# EAGLE board Talon_SDI12 (EAGLE 9.6.2)
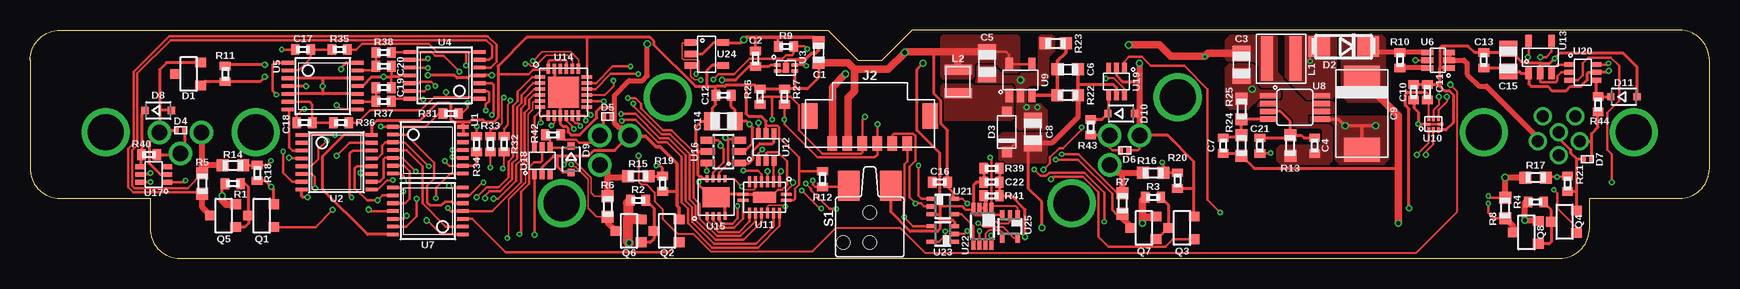
[diagram p3: board, top side]
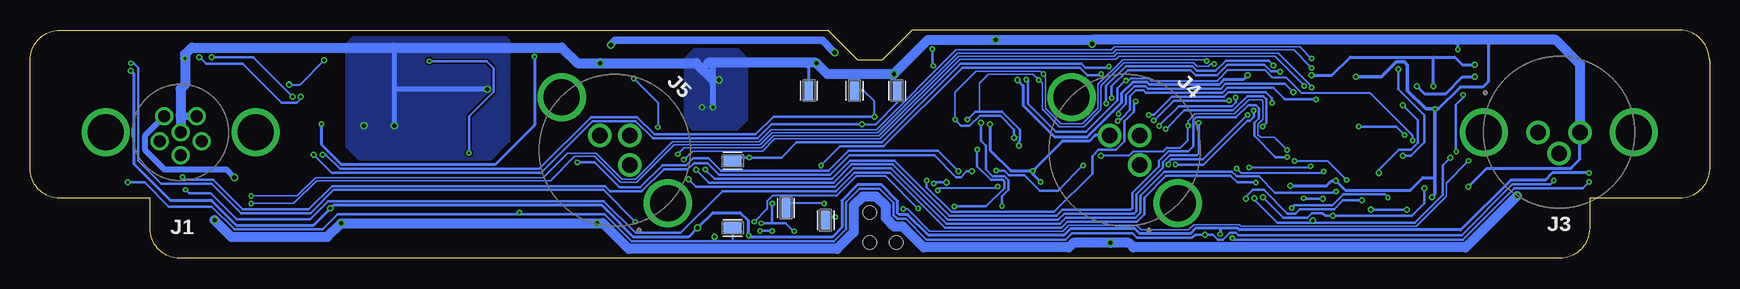
[diagram p4: board, bottom side, seen from below]

Size 140 x 19 mm. Coordinates in mm from the lower left corner, seen from the top.
Outline: 130,5 137.5,5 arc90 140,7.5 140,16.5 arc90 137.5,19 73.5,19 71,16.5 69,16.5 66.5,19 2.5,19 arc90 0,16.5 0,7.5 arc90 2.5,5 10,5 10,2.5 arc90 12.5,0 127.5,0 arc90 130,2.5 130,5
Copper layers (1*16): Top 0.035559375mm / dielectric 1.6mm / Bottom 0.035559375mm
Design rules "jlcpcb-2layer *": minimum track width 5mil, minimum drill 0.2mm, track to track 5mil, track to pad 5mil, pad to pad 5mil, via to via 5mil, smd to smd 5mil, copper to edge 15mil, drill to drill 10mil, minimum pad ring 5mil, minimum via ring 5mil, stop-mask expansion 2.5mil, vias tented up to drill 0mil, thermal gap 10mil

## Footprints (pad centres in the part's own frame; a part is rotated, then mirrored left to right if it is on the bottom)
C0603 = smd 1 x 1: 1 -0.85,0; 2 0.85,0
C0402 = smd 0.7 x 0.9: 1 -0.65,0; 2 0.65,0
C0805 = smd 1.3 x 1.5: 1 -0.95,0; 2 0.95,0
C2917 = smd 2 x 3: + -3,0; - 3,0
SOT23-3 = smd 0.8 x 0.9: 1 -0.95,-1; 2 0.95,-1; 3 0,1.1
DO214AC = smd 1.8 x 1.7: A 2.05,0; C -2.05,0
SOD-123 = smd 0.85 x 0.85: ANODE 1.675,0; CAT -1.675,0
D0402 = smd 0.4 x 0.7: 1 -0.35,0; 2 0.35,0
SOD323-R = smd 0.6 x 0.6: A 1.1,0; C -1.1,0
1X06_M8_PHOENIX_1456022_BOARDLOCK = drill 1: 1 -1.365,-1.32; 2 1.365,-1.32; 3 1.75,0.74; 4 0,1.9; 5 -1.75,0.74; 6 0,0 | drill 3: MNT@1 -6.25,0; MNT@2 6.25,0
1X06_MICROLOCKPLUS = smd 0.8 x 1.2: 1 -3.125,-0.6; 2 -1.875,-0.6; 3 -0.625,-0.6; 4 0.625,-0.6; 5 1.875,-0.6; 6 3.125,-0.6 | smd 1.3 x 2.15: BODY@1 -5.025,1.695; BODY@2 5.025,1.695
1X03_M8_TE_T40410_BOARDLOCK = drill 1.3: 1 1.75,0; 3 -1.75,0; 4 0,1.75 | drill 3: BODY@1 -6.25,0; BODY@2 6.25,0
WE-MAIA(4.1X4.1) = smd 0.98 x 3.7: P$1 -1.185,0; P$2 1.185,0
1008 = smd 0.85 x 2.3: 1 -0.975,0; 2 0.975,0
R0402 = smd 0.7 x 0.9: 1 -0.65,0; 2 0.65,0
R0603 = smd 1 x 1: 1 -0.85,0; 2 0.85,0
ESE-22MH = smd 1.8 x 2.5: 1 -1.75,-2.25; 2 1.75,-2.25 | hole 1.1: 0,0; 0,2.5; 2.2,2.5
TESTPOINT_0603 = smd 1.6 x 0.8: 1 0,0
TSSOP14 = smd 0.305 x 0.991: 1 -1.95,-2.918; 2 -1.3,-2.918; 3 -0.65,-2.918; 4 0,-2.918; 5 0.65,-2.918; 6 1.3,-2.918; 7 1.95,-2.918; 8 1.95,2.918; 9 1.3,2.918; 10 0.65,2.918; 11 0,2.918; 12 -0.65,2.918; 13 -1.3,2.918; 14 -1.95,2.918
TSSOP16 = smd 0.305 x 0.991: 1 -2.275,-2.918; 2 -1.625,-2.918; 3 -0.975,-2.918; 4 -0.325,-2.918; 5 0.325,-2.918; 6 0.975,-2.918; 7 1.625,-2.918; 8 2.275,-2.918; 9 2.275,2.918; 10 1.625,2.918; 11 0.975,2.918; 12 0.325,2.918; 13 -0.325,2.918; 14 -0.975,2.918; 15 -1.625,2.918; 16 -2.275,2.918
TDFN_4 = smd 0.55 x 0.3: 1 -0.725,0.25; 2 -0.725,-0.25; 3 0.725,-0.25; 4 0.725,0.25 | smd 0.5 x 0.86: EP 0,0
SC-70_6 = smd 0.47 x 1: 1 -0.65,-0.9; 2 0,-0.9; 3 0.65,-0.9; 4 0.65,0.9; 5 0,0.9; 6 -0.65,0.9
DGK_S-PDSO-G8 = smd 1.45 x 0.45: 1 -2.2,0.975; 2 -2.2,0.325; 3 -2.2,-0.325; 4 -2.2,-0.975; 5 2.2,-0.975; 6 2.2,-0.325; 7 2.2,0.325; 8 2.2,0.975
DBV0005A = smd 1.1 x 0.6: 1 -1.3,0.95; 2 -1.3,0; 3 -1.3,-0.95; 4 1.3,-0.95; 5 1.3,0.95
UQFN-8_1.4X1.2 = smd 0.55 x 0.25: 1 -0.53,0 | smd 0.25 x 0.45: 2 -0.4,-0.475; 3 0,-0.475; 4 0.4,-0.475; 6 0.4,0.475; 7 0,0.475; 8 -0.4,0.475 | smd 0.45 x 0.25: 5 0.58,0
VQFN-16 = smd 0.9 x 0.24: 1 -1.8,-0.25; 8 1.8,-0.25; 9 1.8,0.25; 16 -1.8,0.25 | smd 0.24 x 0.9: 2 -1.25,-1.3; 3 -0.75,-1.3; 4 -0.25,-1.3; 5 0.25,-1.3; 6 0.75,-1.3; 7 1.25,-1.3; 10 1.25,1.3; 11 0.75,1.3; 12 0.25,1.3; 13 -0.25,1.3; 14 -0.75,1.3; 15 -1.25,1.3 | smd 1.9 x 0.9: EP 0,0
DCK_R-PDSO-G6 = smd 0.4 x 0.9: 1 -0.65,-1.1; 2 0,-1.1; 3 0.65,-1.1; 4 0.65,1.1; 5 0,1.1; 6 -0.65,1.1
SOT23-5 = smd 0.55 x 1: 1 -0.95,-1.35; 2 0,-1.35; 3 0.95,-1.35; 4 0.95,1.35; 5 -0.95,1.35
QFN24 = smd 0.85 x 0.3: 1 -1.95,1.25; 2 -1.95,0.75; 3 -1.95,0.25; 4 -1.95,-0.25; 5 -1.95,-0.75; 6 -1.95,-1.25; 13 1.95,-1.25; 14 1.95,-0.75; 15 1.95,-0.25; 16 1.95,0.25; 17 1.95,0.75; 18 1.95,1.25 | smd 0.3 x 0.85: 7 -1.25,-1.95; 8 -0.75,-1.95; 9 -0.25,-1.95; 10 0.25,-1.95; 11 0.75,-1.95; 12 1.25,-1.95; 19 1.25,1.95; 20 0.75,1.95; 21 0.25,1.95; 22 -0.25,1.95; 23 -0.75,1.95; 24 -1.25,1.95 | smd 2.6 x 2.6: EP 0,0
DFN_8_3X3 = smd 0.6 x 0.25: 1 -1.55,0.75; 2 -1.55,0.25; 3 -1.55,-0.25; 4 -1.55,-0.75; 5 1.55,-0.75; 6 1.55,-0.25; 7 1.55,0.25; 8 1.55,0.75 | smd 1.65 x 2.25: EP 0,0
SOT23-6L = smd 0.55 x 1.2: 1 -0.95,-1.3; 2 0,-1.3; 3 0.95,-1.3; 4 0.95,1.3; 5 0,1.3; 6 -0.95,1.3
DCK_R-PDSO-G5 = smd 0.35 x 0.8: 1 -0.65,-0.95; 2 0,-0.95; 3 0.65,-0.95; 4 0.65,0.95; 5 -0.65,0.95
DCU_(R-PDSO-G8) = smd 0.3 x 0.8: 1 -0.75,-1.55; 2 -0.25,-1.55; 3 0.25,-1.55; 4 0.75,-1.55; 5 0.75,1.55; 6 0.25,1.55; 7 -0.25,1.55; 8 -0.75,1.55

## Placement (x,y rotation side)
C1  1uF  [C0603]  65.74,17.14 90 top
C2  0.1uF  [C0402]  60.48,16.64 90 top
C3  22uF  [C0805]  100.99,16.13 270 top
C4  DNP  [C0402]  107.08,9.4 90 top
C5  4.7uF  [C0805]  79.78,16.26 270 top
C6  220pF  [C0603]  86.51,15.75 180 top
C7  39pF  [C0402]  99.46,9.4 90 top
C8  10uF  [C0805]  83.59,10.54 90 top
C9  100uF  [C2917]  111.02,12.06 270 top
C10  0.1uF  [C0402]  115.34,13.84 90 top
C11  0.1uF  [C0402]  116.48,13.84 90 top
C12  0.1uF  [C0402]  57.81,13.59 0 top
C13  0.1uF  [C0402]  121.18,16.51 90 top
C14  10uF  [C0805]  57.81,11.43 0 top
C15  10uF  [C0805]  123.21,16.51 90 top
C16  0.1uF  [C0402]  75.84,6.35 180 top
C17  DNP  [C0402]  22.76,17.4 180 top
C18  DNP  [C0402]  22.88,11.3 180 top
C19  DNP  [C0402]  29.49,14.22 0 top
C20  DNP  [C0402]  29.49,16 0 top
C21  1pF  [C0402]  102.51,9.4 90 top
C22  3.3nF  [C0402]  80.16,6.35 180 top
D1  2.048V  [SOT23-3]  13.23,15.37 90 top
D2  CDBA3100  [DO214AC]  109.5,17.65 180 top
D3  [SOD-123]  81.43,10.54 90 top
D4  12V  [D0402]  12.55,10.67 0 top
D5  12V  [D0402]  48.16,11.81 180 top
D6  12V  [D0402]  91.25,9 180 top
D7  12V  [D0402]  129.82,8.26 0 top
D8  [SOD323-R]  10.69,12.32 0 top
D9  [SOD323-R]  45.11,8.26 270 top
D10  [SOD323-R]  90.95,12.06 0 top
D11  [SOD323-R]  132.87,13.46 0 top
J1  CONN_APOGEE_LOGGER  [1X06_M8_PHOENIX_1456022_BOARDLOCK]  127.45,10.5 180 bottom
J2  CONN_TALON_REMOTE  [1X06_MICROLOCKPLUS]  70,10.16 0 top
J3  CONN_SDI-12_LOGGERM8_TE_BOARDLOCK  [1X03_M8_TE_T40410_BOARDLOCK]  12.55,10.5 180 bottom
J4  CONN_SDI-12_LOGGERM8_TE_BOARDLOCK  [1X03_M8_TE_T40410_BOARDLOCK]  48.75,9 315 bottom
J5  CONN_SDI-12_LOGGERM8_TE_BOARDLOCK  [1X03_M8_TE_T40410_BOARDLOCK]  91.25,9 315 bottom
L1  6.8uH  [WE-MAIA(4.1X4.1)]  104.29,16.64 0 top
L2  10uH  [1008]  77.37,14.73 270 top
Q1  2N7002  [SOT23-3]  19.33,3.56 90 top
Q2  2N7002  [SOT23-3]  53.11,2.29 90 top
Q3  2N7002  [SOT23-3]  96.03,2.54 90 top
Q4  2N7002  [SOT23-3]  127.91,3.05 90 top
Q5  AO3419  [SOT23-3]  16.15,3.56 90 top
Q6  AO3419  [SOT23-3]  49.93,2.29 90 top
Q7  AO3419  [SOT23-3]  92.86,2.54 90 top
Q8  AO3419  [SOT23-3]  124.74,2.16 90 top
R1  10k  [R0402]  16.91,6.22 180 top
R2  10k  [R0402]  50.7,4.83 180 top
R3  10k  [R0402]  93.62,5.08 180 top
R4  10k  [R0402]  125.51,4.7 180 top
R5  82m  [R0603]  14.37,6.22 90 top
R6  82m  [R0603]  48.16,4.32 90 top
R7  82m  [R0603]  91.08,4.57 90 top
R8  82m  [R0603]  122.96,4.19 90 top
R9  100k  [R0402]  63.02,17.65 0 top
R10  100k  [R0402]  114.2,16.51 90 top
R11  10k  [R0402]  16.28,15.37 90 top
R12  1M  [R0402]  66.06,6.6 90 top
R13  390k  [R0603]  105.05,9.4 270 top
R14  499k  [R0603]  16.91,7.75 0 top
R15  499k  [R0603]  50.7,6.86 0 top
R16  499k  [R0603]  93.62,7.11 0 top
R17  499k  [R0603]  125.51,6.73 0 top
R18  100k  [R0402]  18.95,7.11 90 top
R19  100k  [R0402]  52.73,6.22 90 top
R20  100k  [R0402]  95.65,6.48 90 top
R21  100k  [R0402]  128.17,6.22 90 top
R22  40.2k  [R0603]  86.51,13.59 0 top
R23  13.3k  [R0603]  85.49,17.91 0 top
R24  115k  [R0603]  100.99,9.4 270 top
R25  13.3k  [R0603]  100.99,12.45 270 top
R26  10k  [R0402]  60.86,13.46 90 top
R27  10k  [R0402]  62.89,13.46 90 top
R31  1k  [R0402]  35.08,12.06 180 top
R32  1k  [R0402]  39.52,9.53 270 top
R33  1k  [R0402]  38.38,9.53 270 top
R34  1k  [R0402]  37.23,9.53 270 top
R35  1k  [R0402]  25.8,17.4 180 top
R36  1k  [R0402]  25.93,11.3 180 top
R37  1k  [R0402]  29.49,13.08 180 top
R38  1k  [R0402]  29.49,17.14 180 top
R39  200K  [R0402]  80.16,7.49 0 top
R40  510R  [R0402]  9.93,8.64 180 top
R41  510R  [R0402]  80.16,5.21 180 top
R42  510R  [R0402]  43.58,10.29 180 top
R43  510R  [R0402]  88.41,10.92 90 top
R44  510R  [R0402]  130.71,12.83 90 top
S1  ESE-22MH  [ESE-22MH]  70,3.81 180 top
TP1  TESTPOINTRCU  [TESTPOINT_0603]  75.08,13.97 270 bottom
TP2  TESTPOINTRCU  [TESTPOINT_0603]  76.98,4.19 270 bottom
TP3  TESTPOINTRCU  [TESTPOINT_0603]  73.68,3.17 270 bottom
TP4  TESTPOINTRCU  [TESTPOINT_0603]  81.43,2.54 0 bottom
TP5  TESTPOINTRCU  [TESTPOINT_0603]  81.43,8.13 180 bottom
TP6  TESTPOINTRCU  [TESTPOINT_0603]  71.27,13.97 270 bottom
TP7  TESTPOINTRCU  [TESTPOINT_0603]  67.71,13.97 270 bottom
U1  SN74HC04  [TSSOP14]  33.17,9.02 270 top
U2  CD4044  [TSSOP16]  25.55,8 270 top
U3  SIP32431TDFN  [TDFN_4]  63.02,15.88 0 top
U4  INA4180A2  [TSSOP14]  34.57,15.24 90 top
U5  MAX9034TSSOP  [TSSOP14]  24.41,14.35 270 top
U6  SI1869  [SC-70_6]  117.37,16.51 90 top
U7  SN74AC08  [TSSOP14]  33.17,3.94 90 top
U8  LM2621  [DGK_S-PDSO-G8]  105.43,12.57 0 top
U9  LMR62014SOT23  [DBV0005A]  82.57,14.86 90 top
U10  FXMAR2102UMLP  [UQFN-8_1.4X1.2]  116.99,11.18 0 top
U11  74HC4852  [VQFN-16]  61.24,5.08 180 top
U12  SN74LVC1G3157SC70  [DCK_R-PDSO-G6]  61.36,9.27 0 top
U13  MCP3221  [SOT23-5]  125.88,16.76 0 top
U14  PCAL9535AQFN  [QFN24]  44.47,13.84 0 top
U15  PCA9536DFN  [DFN_8_3X3]  57.17,5.08 90 top
U16  MCP3421A3  [SOT23-6L]  57.81,8.89 90 top
U17  SN74LVC1G3157SC70  [DCK_R-PDSO-G6]  10.31,6.99 90 top
U18  SN74LVC1G3157SC70  [DCK_R-PDSO-G6]  42.7,8.13 0 top
U19  SN74LVC1G3157SC70  [DCK_R-PDSO-G6]  90.57,14.73 180 top
U20  SN74LVC1G3157SC70  [DCK_R-PDSO-G6]  129.44,15.49 270 top
U21  SN74LVC1G00SC70  [DCK_R-PDSO-G5]  76.1,4.32 270 top
U22  SN74LVC2G241DCU  [DCU_(R-PDSO-G8)]  79.4,2.67 180 top
U23  [DCK_R-PDSO-G5]  76.1,2.03 90 top
U24  AT24MAC602SOT23  [SOT23-5]  56.41,17.02 270 top
U25  SN74AUP1T87  [DCK_R-PDSO-G5]  81.68,2.67 180 top

## Tracks (layer width: path | path; a pad name or v marks a point on that pad's centre or on a via)
3V3  (via drill 0.2, 0.35)
  Top 0.152: v79.04,2.92 79.14,2.92 79.45,2.62 81.1,2.62 82,1.72 U25.5
  Top 0.2: U11.16 63.65,4.83 63.78,4.95 63.78,5.8 64.1,6.12 64.1,7.24 | U9.4 U9.5 81.62,16.95 81.37,17.21 C5.1 | v78.13,4.57 77.73,4.97 U21.5 | v115.72,11.18 U10.1 U10.5 | 61.36,11.05 62.31,11.05 62.44,10.91 62.44,10.08 64.1,8.43 64.1,7.24 | v76.29,2.26 76.29,1.92 75.75,1.38 U23.5 | 39.02,15.37 39.04,15.34 41.56,15.34 41.95,15.73 43.16,15.73 U14.24 43.22,16.4 43.33,16.51 44.6,16.51 44.73,16.38 U14.21 | U14.18 46.42,18.36 46.38,18.41 | R12.2 66.05,7.24 64.1,7.24
  Top 0.254: U7.14 28.13,1.99 24.41,5.71 24.41,8.51 26.17,10.28 U2.16 28.47,11.05 28.88,11.46 32.46,11.46 33.94,12.94 34.97,12.94 35.08,12.83 35.08,11.56 35.27,11.36 36.09,11.36 | 59.69,14.45 59.69,12.06 59.94,11.81 60.98,11.81 61.36,11.43 61.36,11.05 U12.5 | 57.17,14.32 57.91,14.32 58.04,14.45 59.69,14.45 | 75.33,17.21 75.33,13.72 75.93,13.12 75.93,11.22 76.49,10.65 C16.1 76.49,5.97 76.98,5.48 76.98,5.03 U21.5 | 97.94,16.82 v97.94,16.8 | C1.1 65.75,15.05 64.81,14.11 63.78,14.11 | 59.69,14.45 60.39,14.45 60.73,14.11 R26.2 R27.2 63.78,14.11 | 57.17,14.32 57.16,14.31 C12.1 57.16,12.81 56.86,12.51 C14.1 55.97,11.43 55.52,10.98 55.52,9.53 55.65,9.39 55.65,8.89 | C10.1 115.34,12.56 115.72,12.17 v115.72,11.18 | 56.41,14.32 55.46,14.32 52.01,17.77 52.01,18.09 51.69,18.41 46.38,18.41 41.41,18.41 39.02,16.01 39.02,15.37 39.02,11.73 38.63,11.35 37.95,11.35 37.74,11.56 36.85,11.56 36.66,11.36 36.09,11.36 | 56.41,14.32 57.17,14.32 | U24.4 56.86,16.07 56.41,15.62 56.41,14.32 | U16.5 55.65,8.89 | U15.8 56.15,6.63 55.95,6.83 55.78,6.83 55.65,6.95 55.65,8.89 | U1.13 U1.14 36.09,11.36 | U3.3 63.74,14.15 63.78,14.11
  Top 0.61: C1.1 68.17,16.3 68.52,15.97 68.73,15.76 | v91.59,17.78 94.13,17.78 95.09,16.82 97.94,16.82 98.19,17.08 C3.1 | 77.37,17.21 75.33,17.21 72.98,17.21 v72.92,17.14 71.54,15.76 68.73,15.76 | 77.37,17.21 C5.1 | L2.1 77.37,17.21 | 68.73,15.76 68.73,13.92 68.17,13.37 68.17,9.61 J2.2
  Bottom 0.2: v76.29,2.26 76.35,2.26 77.02,2.92 78.13,2.92 | 78.13,2.92 v79.04,2.92 | v78.13,4.57 78.13,2.92
  Bottom 0.254: v97.94,16.8 97.94,11.1 101.24,7.8 114,7.8 115.72,9.52 v115.72,11.18
  Bottom 0.61: v91.59,17.78 91.21,18.16 73.94,18.16 v72.92,17.14
  pour Top (no thermals): 82.45,15.62 82.45,18.41 82.19,18.67 76.22,18.67 75.97,18.41 75.97,15.11 76.1,14.99 78.51,14.99 78.64,15.11 78.64,16.13 78.89,16.38 80.41,16.38 81.3,15.49 82.32,15.49
  pour Top (rank 2, no thermals): 99.72,18.16 100.23,18.67 103.66,18.67 103.91,18.41 103.91,15.49 106.19,13.21 108.35,13.21 108.61,12.95 108.61,8.26 108.23,7.87 104.29,7.87 104.04,8.13 104.04,9.14 104.29,9.4 107.59,9.4 107.85,9.65 107.85,10.67 107.59,10.92 105.05,10.92 104.42,11.56 104.42,12.19 104.04,12.57 102.51,12.57 102.38,12.7 102.38,13.08 102.51,13.21 104.16,13.21 104.29,13.34 104.29,13.84 104.04,14.1 102.64,14.1 102.26,14.48 102.26,16 101.75,16.51 99.84,16.51 99.72,16.64
3V3_SENSE  (via drill 0.25)
  Top 0.254: v33.17,15.24 35.38,15.24 35.59,15.03 36.52,15.03 36.72,15.24 U4.4 v38.5,15.24 | v23.01,14.35 U5.4 | v19.58,16.13 16.37,16.13 R11.2 | v57.68,14.86 58.82,14.86 59.95,15.99 C2.1 61.6,15.99 61.74,16.13 U3.1
  Bottom 0.254: v33.17,15.24 31.48,15.24 29.95,16.77 23.01,16.77 | v19.58,16.13 20.6,16.13 21.23,16.77 23.01,16.77 | v57.68,14.86 57.21,14.39 57.21,12.74 54.61,10.14 51.85,10.14 48.98,13.01 48.98,13.78 48.08,14.68 46.89,14.68 46.68,14.48 40.89,14.48 40.48,14.88 38.86,14.88 v38.5,15.24 | v23.01,14.35 23.01,16.77
5V  (via drill 0.2, 0.25, 0.35)
  Top 0.152: U10.8 116.59,13.09 C11.1
  Top 0.2: v40.79,2 40.92,2.13 40.92,5.53 41.62,6.23 41.62,7.6 42.02,8 42.57,8 42.7,8.13 U18.5
  Top 0.254: D3.CAT 82.16,9.59 | v84.35,2.54 84.35,4.7 83.21,5.84 83.21,9.21 C8.1 | U19.5 90.57,14.22 90.32,14.48 87.36,14.48 | v131.59,15.62 131.47,15.49 U20.5 129.92,15.49 129.83,15.4 129.83,14.87 129.28,14.32 128.4,14.32 128.04,13.97 126.86,13.97 126.5,14.32 125.15,14.32 124.93,14.54 U13.1 124.31,15.41 124.16,15.56 C15.1 122.91,15.86 C13.1 | v114.96,4.17 114.96,12.41 114.63,12.74 114.63,13.65 114.83,13.84 116.35,13.84 116.48,13.72 C11.1 | v10.06,7.11 9.93,6.99 U17.5 | v80.1,1.91 80.15,1.86 U22.8
  Top 0.305: C6.1 87.36,14.48 R22.2
  Top 0.406: R22.2 87.36,11.77 85.18,9.59 C8.1
  Bottom 0.254: v10.06,7.11 13.1,7.11 13.7,6.52 16.57,6.52 20.73,2.36 39.19,2.36 39.32,2.49 40.79,2.49 | v131.59,15.62 131.32,15.34 131.32,7.84 128.27,4.8 124.84,4.8 122.81,2.77 116.35,2.77 v114.96,4.17 114.71,4.42 92.33,4.42 91.87,3.96 91.87,3.95 89.69,1.77 85.12,1.77 v84.35,2.54 83.08,3.81 80.8,3.81 80.1,3.12 v80.1,1.91 79.97,1.77 73.12,1.77 72.33,2.57 72.33,4.81 71,6.13 69.04,6.13 67.67,4.77 67.67,3.75 67.56,3.63 66.84,3.63 65.1,1.9 53.82,1.9 53.27,2.45 47.88,2.45 47.5,2.06 43.29,2.06 42.86,2.49 40.79,2.49 | 40.79,2.49 v40.79,2
  pour Top (no thermals): 84.61,10.41 81.05,10.41 80.8,10.16 80.8,8.26 81.05,8 84.61,8 84.73,8.13 84.73,10.29
12V  (via drill 0.35)
  Top 0.254: 114.07,7.49 102.04,7.49 R24.2 100.79,8.75 C7.1 | v16.02,5.21 16.02,5.86 16.26,6.1 R1.2
  Top 0.406: 111.84,17.36 D2.C 112.04,17.16 R10.2 U6.4
  Top 0.508: R4.2 124.61,4.65 v124.61,3.17 124.68,3.11 Q8.2
  Top 0.61: C9.+ 111.02,14.94 114.07,11.89 114.07,7.49 v114.07,2.92 | v16.02,5.21 16.02,4.83 16.34,4.51 Q5.2 | v92.73,2.92 92.73,3.43 | 92.73,3.43 92.73,4.84 R3.2 | Q7.2 93.8,3.43 92.73,3.43
  Top 0.813: 49.85,3.3 49.85,1.38 v49.93,1.29 | R2.2 49.85,4.63 49.85,3.3 | Q6.2 49.91,3.24 49.85,3.3
  Bottom 0.813: v124.61,3.17 123.21,1.78 115.21,1.78 v114.07,2.92 v92.73,2.92 92.24,2.92 90.1,0.79 72.71,0.79 71.34,2.16 71.34,4.4 70.59,5.15 69.45,5.15 68.66,4.36 68.66,3.34 67.97,2.65 67.25,2.65 65.51,0.91 53.41,0.91 53.03,1.29 v49.93,1.29 48.41,1.29 48.03,0.91 20.32,0.91 v16.02,5.21
  pour Top (no thermals): 109.37,17.78 109.37,13.59 109.88,13.08 112.55,13.08 112.93,13.46 112.93,18.29 112.67,18.54 109.62,18.54 109.5,18.41 109.37,18.29
!DATA_EN4  (via drill 0.2)
  Top 0.127: U1.10 35.27,8.37 v35.2,8.44
  Top 0.2: v83.72,7.39 84.22,6.88 84.71,6.88 84.97,7.14 87.89,7.14 89.56,5.48 v89.56,3.05 | U20.6 131.48,16.14 v131.59,16.26
  Bottom 0.2: v89.56,3.05 92.21,5.7 114.68,5.7 116.62,3.76 122.41,3.76 124.88,6.23 129.06,6.23 130.96,8.13 130.96,14.91 130.96,14.92 130.96,15.88 131.34,16.26 v131.59,16.26 | v83.72,7.39 82.95,6.62 73.16,6.62 71.64,8.15 67.95,8.15 63.34,3.53 54.43,3.53 53.93,4.04 48.25,4.04 48.1,4.19 48.1,5.47 45.89,7.69 45.89,8.14 45.11,8.91 43.44,8.91 43.02,9.32 43.02,11.48 42.76,11.75 39.47,11.75 38.45,12.77 37.81,12.77 37.54,12.51 37.54,11.69 37.94,11.29 37.94,10.19 36.19,8.44 v35.2,8.44
!FAULT1  (via drill 0.2, 0.25)
  Top 0.2: U1.8 35.03,7.07 33.85,5.88 v33.85,5 | U7.13 31.36,2.64 32.24,3.51 v32.24,4.95
  Bottom 0.2: v32.24,4.95 33.79,4.95 v33.85,5
!FAULT2
  Top 0.2: U1.4 31.39,9.02 32.73,7.67 32.73,4.57 34.67,2.64 U7.2
!FAULT3
  Top 0.2: U1.6 31.17,7.72 31.65,7.24 31.65,4.95 31.27,4.57 30.27,4.57 U7.10
!FAULT4
  Top 0.2: U1.2 31.36,10.32 33.7,7.98 33.7,6.63 33.12,6.04 33.12,4.65 33.35,4.42 34.29,4.42 34.59,4.71 35.2,4.71 35.33,4.59 U7.5
!RX  (via drill 0.2)
  Top 0.2: U22.6 v79.15,2.28 v79.14,2.29 | v78.13,2.28 77.88,2.03 U23.2
  Bottom 0.2: v79.14,2.29 v79.14,2.28 v78.13,2.28
DATA  (via drill 0.2, 0.25)
  Top 0.2: v99.21,3.81 98.16,4.86 98.16,14.09 96.21,16.04 93.45,16.04 92.7,16.79 91.62,16.79 91.22,16.39 U19.1 | v131.85,6.35 131.85,8.66 131.47,9.04 131.47,12.14 132.46,13.13 132.46,16.04 131.77,16.73 129.91,16.73 129.44,16.26 129.44,15.24 129.04,14.84 U20.3 | v12.98,6.48 12.84,6.33 U17.1 | U18.1 42.06,7.01 v42.06,1.98
  Top 0.254: R39.2 C22.1 R41.1 81.81,5.21 82.95,4.06 v82.95,1.78
  Bottom 0.152: TP4.1 81.43,1.42
  Bottom 0.2: 82.95,1.42 89.84,1.42 92.1,3.68 99.08,3.68 v99.21,3.81 99.34,3.68 114.35,3.68 115.62,2.41 122.95,2.41 124.86,4.32 128.42,4.32 130.45,6.35 v131.85,6.35 | v82.95,1.78 82.95,1.42 | 82.95,1.42 81.43,1.42 72.97,1.42 71.97,2.42 71.97,4.67 70.86,5.78 69.18,5.78 68.03,4.63 68.03,3.6 67.71,3.28 66.98,3.28 65.25,1.55 53.67,1.55 53.13,2.09 48.11,2.09 47.73,1.71 43.14,1.71 42.88,1.98 v42.06,1.98 41.41,1.98 40.98,1.55 40.54,1.55 39.96,2.13 39.46,2.13 39.26,1.93 20.66,1.93 16.42,6.17 13.29,6.17 v12.98,6.48
DATA_EN1  (via drill 0.2)
  Top 0.127: v39.77,1.68 39.9,1.8 39.9,4.92 41.33,6.35 41.33,7.72 41.53,7.92 41.53,12.02 41.91,12.39 41.91,12.95 42.05,13.09 U14.5
  Top 0.254: v10.06,6.35 9.23,6.35 U17.6
  Bottom 0.2: v10.06,6.35 10.57,5.84 16.29,5.84 20.58,1.55 39.65,1.55 v39.77,1.68
DATA_EN2
  Top 0.2: U14.6 42.52,12.27 42.05,11.79 U18.6
DATA_EN3  (via drill 0.2, 0.25)
  Top 0.152: v89.69,14.99 90.36,14.99 91.22,14.12 U19.6
  Top 0.2: v84.48,7.37 85.04,7.92 85.04,8.4 85.79,9.16 86.12,9.16 87.65,10.7 v87.65,10.92 | v42.57,11.3 42.57,11.68 42.78,11.89 U14.7
  Bottom 0.152: v89.69,14.99 87.65,12.95 v87.65,10.92
  Bottom 0.2: v84.48,7.37 83.41,6.3 73.03,6.3 71.5,7.82 68.09,7.82 63.47,3.21 54.3,3.21 53.79,3.71 48,3.71 47.77,3.94 47.77,5.34 45.56,7.55 45.56,8 44.98,8.58 42.74,8.58 42.57,8.76 v42.57,11.3
DATA_EN4  (via drill 0.2, 0.25)
  Top 0.127: U1.11 v35.2,9.02 | v43.48,11.05 43.72,11.3 U14.8
  Top 0.152: v50.74,8.55 50.74,6.38 50.96,6.16 51.4,6.16 52.08,5.48 52.08,4.76 52.73,4.11 52.73,3.3 54,2.03 55.28,2.03 56.74,0.58 65.24,0.58 67.21,2.54 72.54,2.54 74.62,0.46 115.54,0.46 118.97,3.89 118.97,13.9 v118.39,14.48 | v115.47,16.51 U6.5
  Bottom 0.127: v35.2,9.02 36.25,10.07 37.41,10.07 37.65,10.31 37.65,11.17 37.22,11.6 37.22,13.08 37.36,13.23 38.41,13.23 39.59,12.04 42.88,12.04 43.48,11.44 v43.48,11.05
  Bottom 0.152: v50.74,8.55 48.39,8.55 48,8.94 45.51,8.94 45.24,9.21 44.11,9.21 43.48,9.85 v43.48,11.05 | v118.39,14.48 117.5,14.48 v115.47,16.51
DATA_OUT1
  Top 0.254: R40.1 12.44,8.64 J3.4 12.9,9.1 D4.2
DATA_OUT2
  Top 0.2: J4.4 46.89,9.61 45.78,9.61 45.51,9.88 44.64,9.88 R42.1
  Top 0.254: J4.4 47.81,10.53 D5.2
DATA_OUT3
  Top 0.2: D6.2 90.21,9 90.01,9.2 J5.4
  Top 0.254: J5.4 88.45,10.24 R43.1
DATA_OUT4
  Top 0.254: 130.17,9.78 130.17,10.16 130.17,10.38 130.71,10.92 R44.1 | J1.3 130.15,9.76 130.17,9.78 | D7.2 130.17,9.78
DATA_OUT_PROTEC1
  Top 0.254: D8.C 9.32,12.04 9.32,8.67 R40.2 9.21,8.57 U17.4
DATA_OUT_PROTEC2
  Top 0.2: D9.C 44.98,9.23 U18.4 43.34,9.88 R42.2
DATA_OUT_PROTEC3
  Top 0.254: R43.2 89.36,11.57 D10.C 89.92,12.13 U19.4
DATA_OUT_PROTEC4
  Top 0.254: U20.4 130.58,14.84 130.58,13.6 R44.2 131.75,13.48 D11.C
DATA_PROTEC
  Top 0.254: U22.3 U22.2 79.65,5.07 R41.2
DATA_SENSE4
  Top 0.2: U13.3 126.83,15.67 127.31,16.14 U20.1
DIR  (via drill 0.2)
  Top 0.152: U25.1 82.33,4.18 82.19,4.32 80.25,4.32 U22.1
  Top 0.2: v80.03,8.4 80.15,8.28 U22.1 | U14.17 47.17,14.59 48.58,16 v50.06,16
  Bottom 0.2: v50.06,16 50.19,15.88 52,15.88 52.34,16.22 62.42,16.22 68.97,9.66 76.1,9.66 77.37,8.4 v80.03,8.4 81.16,8.4 TP5.1
DIR_BYPASS
  Top 0.152: U25.4 81.03,2.17 80.87,2.33 79.92,2.33 79.65,2.06 U22.7
EN1  (via drill 0.25)
  Top 0.2: v31.39,3.53 31.15,3.29 U7.12 | v23.77,5.84 23.71,5.91 23.71,6.79 23.48,7.03 U2.6 | v37.23,5.08 38.06,5.92 39.05,5.92 39.88,6.74 39.88,8.06 40.26,8.45 40.26,12.73 40.64,13.11 40.64,13.87 41.86,15.09 U14.1
  Bottom 0.2: v23.77,5.84 23.77,4.57 24.81,3.53 v31.39,3.53 32.03,3.53 32.26,3.76 33.13,3.76 33.51,3.38 35.53,3.38 v37.23,5.08
EN2  (via drill 0.25)
  Top 0.2: v33.06,3.15 33.11,3.15 34.28,1.99 U7.1 | v37.93,5.02 37.93,5.22 38.3,5.59 39.19,5.59 40.2,6.61 40.2,7.93 40.59,8.31 40.59,12.58 40.96,12.95 40.96,13.61 41.95,14.59 U14.2 | v21.61,8.38 21.67,8.33 U2.4
  Bottom 0.2: v37.93,5.02 37.93,4.89 36.01,2.98 33.04,2.98 | v21.61,8.38 22.25,7.75 22.25,5.29 24.56,2.98 33.04,2.98 | v33.06,3.15 33.06,3 33.04,2.98
EN3  (via drill 0.25)
  Top 0.2: U2.12 27.26,7.68 27.07,7.49 27.07,5.84 28.09,4.83 v28.98,4.83 29.39,5.24 U7.9 | v38.63,4.95 39.01,4.95 40.54,6.48 40.54,7.8 40.92,8.18 40.92,12.45 41.29,12.82 41.29,13.35 42.04,14.09 U14.3
  Bottom 0.2: v38.63,4.95 38.63,5.13 38.07,5.69 37.16,5.69 35.17,3.71 34.53,3.71 34.15,4.09 31.29,4.09 30.55,4.83 v28.98,4.83
EN4  (via drill 0.2)
  Top 0.2: U2.14 26.91,8.98 26.67,8.74 26.67,5.22 v26.81,5.07 | v34.82,4.19 35.08,3.94 U7.4 38.5,3.94 40.92,6.35 40.92,7.72 41.24,8.04 41.24,12.14 41.62,12.51 41.62,13.21 42,13.59 U14.4
  Bottom 0.2: v26.81,5.07 27.07,5.33 30.51,5.33 31.42,4.42 34.6,4.42 v34.82,4.19
FAULT1  (via drill 0.2)
  Top 0.152: U2.9 28.99,5.73 29.78,6.52 v30.25,6.52 | v34.57,8.1 34.95,7.72 U1.9
  Top 0.2: U1.9 37.08,7.72 37.23,7.87 R34.2
  Bottom 0.152: v30.25,6.52 31.83,8.1 v34.57,8.1
FAULT1_SENSE  (via drill 0.2)
  Top 0.2: v37.23,10.99 R34.1 | v45.32,10.77 45.19,10.89 45.19,10.99 44.72,11.46 U14.10
  Bottom 0.2: v37.23,10.99 36.93,11.3 36.93,13.23 37.21,13.52 38.53,13.52 39.71,12.33 43.76,12.33 v45.32,10.77
FAULT2  (via drill 0.2)
  Top 0.152: U1.3 31.25,9.67 v33.25,7.67 | v38.38,7.56 R33.2
  Top 0.2: U2.13 28.98,8.33 29.36,8.7 29.36,9.4 29.63,9.67 U1.3
  Bottom 0.152: v33.25,7.67 33.38,7.54 38.36,7.54 v38.38,7.56
FAULT2_SENSE  (via drill 0.2)
  Top 0.152: v39.5,13.39 39.34,13.24 39.34,11.26 38.89,10.79 38.52,10.79 38.38,10.66 R33.1
  Top 0.2: v45.88,11.03 45.67,11.24 45.48,11.24 45.22,11.5 U14.11
  Bottom 0.2: v39.5,13.39 39.5,13.01 39.82,12.69 44.22,12.69 v45.88,11.03
FAULT3  (via drill 0.2)
  Top 0.152: U1.5 31.03,8.37 v32.15,7.24 | v39.42,7.49 39.52,7.59 R32.2
  Top 0.2: U1.5 29.6,8.37 29.49,8.26 29.49,6.73 29.23,6.48 29.13,6.38 U2.10
  Bottom 0.152: v32.15,7.24 32.26,7.13 39.06,7.13 v39.42,7.49
FAULT3_SENSE  (via drill 0.2)
  Top 0.152: v40.03,13.14 40.03,13 39.83,12.8 39.83,11.12 39.52,10.81 R32.1
  Top 0.2: v46.33,11.48 46.33,11.73 46.17,11.89 U14.12
  Bottom 0.2: v46.33,11.48 44.67,13.14 v40.03,13.14
FAULT4  (via drill 0.2)
  Top 0.2: R31.2 34.06,12.06 32.96,10.97 U1.1 29.24,10.97 v29.23,10.98 | v25.42,10.29 25.41,10.28 U2.1
  Bottom 0.2: v29.23,10.98 26.11,10.98 v25.42,10.29
FAULT4_SENSE  (via drill 0.2)
  Top 0.2: v36.47,12.95 36.47,12.56 35.98,12.06 R31.1 | v46.76,11.95 46.42,12.28 U14.13
  Bottom 0.2: v36.47,12.95 36.47,13.34 36.98,13.84 40.1,13.84 40.47,13.47 44.8,13.47 46.33,11.95 v46.76,11.95
FOUT  (via drill 0.2)
  Top 0.2: U21.1 74.3,4.97 74.06,5.21 v74.06,7.73 | v50.7,15.37 48.41,15.37 47.14,14.09 U14.16
  Bottom 0.2: v50.7,15.37 50.82,15.24 51.83,15.24 52.48,15.89 62.28,15.89 68.84,9.34 72.46,9.34 v74.06,7.73
GND  (via drill 0.2, 0.25, 0.35)
  Top 0.2: U16.6 56.41,7.84 v56.41,7.29 | U11.EP 61.74,5.08 62.37,5.7 62.7,5.7 63.09,6.09 63.09,8.07 62.31,8.85 61.47,8.85 61.36,8.75 U12.2 | v31.14,6.45 31.14,6.83 30.91,7.07 U1.7 | U7.7 35.08,5.89 v34.92,6.04 | 75.84,4.32 77.74,4.32 77.99,4.06 78.64,4.06 | D6.1 92.34,9 92.48,9.14 92.48,10.24 | C18.2 22.23,11.92 22.76,12.45 v22.88,12.45 | C17.2 v20.98,17.4 | U22.4 78.65,4.08 78.64,4.06 | U20.2 127.66,15.49 127.33,15.17 127.33,14.82 127.19,14.68 125.93,14.68 125.88,14.73 U13.2 | C20.2 30.14,15.13 30.12,15.11 30.12,14.24 C19.2 | U25.3 80.42,3.62 80.39,3.59 78.78,3.59 78.64,3.72 78.64,4.06
  Top 0.254: U5.11 27.71,14.35 28.47,15.11 v29.49,15.11 30.12,15.11 30.76,15.11 30.89,15.24 U4.11 | U15.EP 57.42,5.33 U11.8 60.99,5.33 U11.EP | U15.4 57.92,4.33 U15.EP | U16.2 59.52,8.89 60.23,9.61 60.23,10.91 v59.97,11.18 59.71,11.43 C14.2 58.76,12.38 58.46,12.69 C12.2 | v23.14,5.08 22.76,5.08 22.63,5.2 U2.8 | 75.84,3.68 75.84,4.32 75.84,6.35 | U21.3 75.16,3.68 75.84,3.68 | D1.2 11.39,16.32 10.8,15.73 10.8,12.32 | 10.8,12.32 J3.3 | J4.3 49.92,10.17 48.74,8.99 47,8.99 46.56,8.55 43.97,8.55 | U3.2 62.89,15.62 63.02,15.75 U3.EP | 92.48,10.24 J5.3 94.83,10.24 97.03,8.04 97.03,5.84 | U19.2 90.57,15.24 91.08,14.73 92.48,14.73 | 117.52,15.88 117.52,17.55 117.66,17.69 119.87,17.69 120.4,17.16 C13.2 122.91,17.16 C15.2 124.42,16.26 125.88,16.26 | U6.1 117.53,15.86 117.52,15.88 | R9.1 62.37,18.42 62.38,18.43 | C2.2 60.48,18.43 | C10.2 C11.2 117.5,14.49 117.52,14.48 | 117.52,14.48 117.52,14.33 117.88,13.97 118.3,13.97 118.64,13.63 118.64,11.3 118.04,10.7 U10.4 | 117.52,14.48 117.52,15.88 | U24.2 56.03,17.02 56.98,17.97 U24.5 59.26,17.97 v59.5,18.21 | 48.71,12.57 47.56,12.57 47.24,12.26 47.24,11.7 45.82,10.29 45.09,10.29 44.84,10.54 44.84,10.84 44.69,10.99 44.4,10.99 44.22,11.18 U14.9 44.22,13.59 U14.EP 43.72,14.59 U14.23 | D5.1 48.71,11.81 | D9.A 44.43,7.16 43.97,7.62 43.97,8.55 | D8.A 10.8,12.32 | U22.4 78.65,6.12 78.88,6.35 C22.2 R39.1 | 128.91,5.59 128.91,6.46 128.92,6.47 128.92,8.3 | D11.A 133.97,15.92 132.81,17.08 127.52,17.08 v127.07,16.64 126.69,16.26 125.88,16.26 | D10.A 92.48,12.06 | 75.84,3.68 75.84,3.17 | 75.84,3.17 75.84,2.44 75.65,2.25 73.36,2.25 71.75,3.87 S1.1 | 75.84,3.17 76.93,3.17 77.05,3.06 U23.3
  Top 0.254: v74.44,16.26 73.94,15.75 73.94,10.67 75.84,8.76 75.84,6.35 | U13.2 125.88,16.26 | U17.2 10.86,6.99 9.93,7.92 9.93,9.63 J3.3 | J1.6 127.45,10.02 128.45,9.02 128.45,8.76 128.92,8.3 | D7.1 128.96,8.26 128.92,8.3 | U18.2 42.7,7.57 43.67,8.55 43.97,8.55 | 128.91,5.59 Q4.2 | Q1.2 20.33,5.73 v20.09,5.97 19.6,6.46 R18.1 | Q3.2 97.03,5.84 | R20.1 95.67,5.84 97.03,5.84 | R21.1 128.18,5.59 128.91,5.59 | R19.1 52.74,5.59 53.94,5.59 | v55.75,6.35 55.75,6.12 56.79,5.08 U15.EP | J3.3 10.97,10.67 D4.1 | C16.2 75.84,6.35
  Top 0.305: U3.EP 63.02,16.38 63.19,16.55 64.61,16.55 65.13,17.07 65.48,17.07 65.75,17.33 C1.2 65.31,18.43 62.38,18.43 60.48,18.43 59.72,18.43 v59.5,18.21 | 111.02,11.05 v109.62,11.05 109.08,11.6 U8.5 | 111.02,11.05 v112.16,11.05 | C9.- 111.02,11.05 | Q2.2 54.11,4.2 53.94,4.37 53.94,5.59 53.94,7.87 52.5,9.3 52.2,9.3 51.33,10.17 49.92,10.17
  Top 0.406: J4.3 49.34,10.89 49.08,10.89 48.71,11.26 48.71,11.81 48.71,12.57 48.71,13.57 49.95,14.81 51.05,14.81 51.46,15.21 v51.46,17.85
  Top 0.508: v92.48,16.26 92.48,14.73 92.48,12.06 92.48,10.24
  Top 0.61: J2.1 66.88,14.27 v67.97,15.37
  Bottom 0.2: v20.98,17.4 20.98,18.09 21.1,18.21
  Bottom 0.254: v59.97,11.18 59.97,9.01 58.24,7.29 v56.41,7.29 | v34.92,6.04 31.93,6.04 31.52,6.45 v31.14,6.45 30.37,5.68 24.95,5.68 23.9,6.73 22.88,6.73 | v20.09,5.97 18.56,7.49 11.56,7.49 10.8,8.26 J3.3 | J4.3 51.22,10.24 51.69,9.76 53.94,9.76 v56.41,7.29 | 18.44,18.21 18.44,14.73 18.91,14.26 20.78,14.26 22.6,12.45 v22.88,12.45 | TP1.1 75.08,16.17 75.21,16.29 | v56.41,7.29 56.41,7.01 v55.75,6.35 | v51.46,17.85 51.46,18.21
  Bottom 0.305: v29.49,15.11 27.34,15.11 26.09,16.36 25.42,16.36 25.17,16.11 25.17,13.96 23.65,12.45 v22.88,12.45 22.88,6.73 22.88,5.33 v23.14,5.08
  Bottom 0.406: v109.62,11.05 109.62,14.1 | 109.62,14.1 109.62,17.44 109.75,17.56 | v101.88,14.1 109.62,14.1
  Bottom 0.508: v83.08,12.57 83.08,14.86 83.08,15.91 83.46,16.29
  Bottom 0.61: J1.1 127.33,11.82 127.45,11.94
  Bottom 0.813: J3.3 10.8,16.19 12.82,18.21 18.44,18.21 21.1,18.21 51.46,18.21 v59.5,18.21 65.13,18.21 v67.97,15.37 73.56,15.37 v74.44,16.26 74.48,16.29 75.21,16.29 83.46,16.29 | J1.6 127.45,11.94 127.45,14.1 127.07,14.48 v127.07,16.64 127.07,17.01 126.52,17.56 109.75,17.56 95.67,17.56 94.36,16.26 v92.48,16.26 84.48,16.26 83.08,14.86
  other vias: 83.97,12.57 82.57,14.86
  pour Top (rank 2, no thermals): 78.89,16.13 78.89,14.61 79.02,14.48 81.81,14.48 82.19,14.1 82.19,11.05 82.57,10.67 84.48,10.67 84.73,10.92 84.73,12.32 84.22,12.83 83.21,12.83 83.08,12.95 83.08,14.22 83.34,14.48 84.35,14.48 84.86,14.99 84.86,16.76 85.37,17.27 85.37,18.41 85.11,18.67 84.35,18.67 84.1,18.41 84.1,15.62 83.84,15.37 81.18,15.37 80.29,16.26 79.02,16.26
  pour Bottom: 81.04,17.4 84.62,17.4 85.37,16.65 85.37,11.43 84.73,10.79 81.05,10.79 80.29,11.56 80.29,16.65
  pour Top (no thermals): 99.97,16.13 101.88,16.13 102.13,15.88 102.13,14.35 102.51,13.97 104.04,13.97 104.16,13.84 104.16,13.46 104.04,13.34 102.38,13.34 101.5,12.45 100.1,12.45 99.72,12.83 99.72,15.88
  pour Top (no thermals): 106.83,11.81 113.18,11.81 113.18,8.26 112.8,7.87 109.24,7.87 108.86,8.26 108.86,11.05 108.48,11.43 106.83,11.43
  pour Bottom (no thermals): 102.13,18.41 100.35,18.41 100.1,18.16 100.1,9.78 101.62,8.26 112.55,8.26 113.56,9.27 113.56,17.91 113.05,18.41
LATCH1  (via drill 0.2)
  Top 0.2: U5.1 20.39,16.3 20.22,16.13 20.22,13.95 v20.54,13.63 | U2.7 21.84,6.38 21.1,7.11 v21.1,8.89
  Bottom 0.2: v20.54,13.63 20.54,13.42 21.16,12.8 21.16,8.95 v21.1,8.89
LATCH2
  Top 0.2: U5.7 21.62,12.27 21.62,9.27 21.91,8.98 U2.3
LATCH3  (via drill 0.25)
  Top 0.2: U5.8 25.93,12.4 v25.58,12.76 | U2.11 27.64,7.03 v27.56,7.11
  Bottom 0.2: v25.58,12.76 24.3,11.49 24.3,9.61 24.89,9.03 25.9,9.03 27.56,7.37 v27.56,7.11
LATCH4  (via drill 0.25)
  Top 0.2: v25.55,8.54 26.63,9.63 U2.15
  Top 0.254: v25.93,15.77 25.93,15.88 26.36,16.3 U5.14
  Bottom 0.2: v25.55,8.54 24.91,8.54 23.77,9.69 23.77,11.93 25.93,14.09 v25.93,15.77
MOS_CTRL1  (via drill 0.25)
  Top 0.2: v25.23,4.04 23.8,2.61 Q1.1 | U7.11 28.34,3.94 v28.22,4.06
  Bottom 0.2: v25.23,4.04 25.25,4.06 v28.22,4.06
MOS_CTRL2
  Top 0.2: U7.3 36.87,3.29 39.65,0.51 53.24,0.51 54.06,1.34 Q2.1
MOS_CTRL3  (via drill 0.2, 0.25)
  Top 0.2: U7.8 30.95,5.89 31.13,5.71 v31.13,5.58 | Q3.1 95.26,1.59 94.63,0.96 89.89,0.96 89.07,1.78 89.07,5.51 87.76,6.82 85.33,6.82 v85.11,6.6
  Bottom 0.2: v31.13,5.58 31.32,5.58 31.44,5.46 36.22,5.46 37.58,6.83 39.4,6.83 39.79,7.22 45.43,7.22 47.45,5.2 47.45,3.8 47.86,3.39 53.66,3.39 54.16,2.88 63.61,2.88 68.22,7.49 71.37,7.49 72.89,5.97 84.48,5.97 v85.11,6.6
MOS_CTRL4  (via drill 0.2)
  Top 0.2: v127.02,5.71 127.31,5.43 127.31,4.17 128.91,2.57 Q4.1 | U7.6 36.63,5.24 37.72,6.33 v37.81,6.33
  Bottom 0.2: v127.02,5.71 126.71,5.41 124.94,5.41 122.79,3.25 116.66,3.25 115.14,4.77 92.18,4.77 89.54,2.13 85.76,2.13 82.29,5.6 72.8,5.6 71.28,7.12 68.31,7.12 64.33,3.13 63.74,2.55 54.03,2.55 53.52,3.06 47.73,3.06 47.12,3.67 47.12,5.07 45.29,6.89 39.93,6.89 39.36,6.33 v37.81,6.33
MUX_EN  (via drill 0.2)
  Top 0.127: U11.6 60.49,5.86 60.35,5.72 59.55,5.72 59.33,5.94 v59.33,5.97 58.67,6.63 U15.5
  Top 0.152: v64.35,5.65 65.86,4.14 v65.98,4.14 | v79.62,3.05 80.56,3.05 80.67,2.93 81.56,2.93 81.68,3.05 U25.2
  Bottom 0.152: v59.33,5.97 59.44,5.86 64.14,5.86 v64.35,5.65 | v65.98,4.14 68.65,6.82 71.14,6.82 72.77,5.19 78.11,5.19 78.56,4.75 78.56,4.11 v79.62,3.05
MUX_SEL0
  Top 0.2: U15.1 56.42,3.18 57.41,2.19 59.11,2.19 59.99,3.07 U11.10
MUX_SEL1
  Top 0.2: U15.2 56.92,3.17 57.55,2.54 58.7,2.54 59.44,3.28 U11.9
MUX_SEL2  (via drill 0.2, 0.25 pad 0.13)
  Top 0.2: U15.3 57.42,3.17 57.7,2.89 58.55,2.89 58.98,3.32 v58.98,4.35 | v60.73,11.3 60.73,10.39 U12.6
  Bottom 0.2: v60.73,11.3 60.73,9.81 60.32,9.4 60.32,7.42 59.76,6.86 58.78,6.86 58.44,6.52 58.44,5.71 58.98,5.18 v58.98,4.35
N$1
  Top 0.254: Q6.1 51.7,1.34 52.01,1.65 Q2.3 52.01,4.16 R2.1
N$2
  Top 0.254: Q5.1 17.91,2.61 18.23,2.92 Q1.3 18.23,5.93 17.93,6.22 R1.1
N$3
  Top 0.254: Q7.1 93.94,1.59 94.89,2.54 Q3.3 94.94,4.42 R3.1
N$4
  Top 0.254: Q8.1 126.63,1.21 126.81,1.4 Q4.3 126.81,4.05 R4.1
N$5
  Top 0.2: U21.4 77.64,3.67 78.65,2.65 U22.5
N$7
  Top 0.254: R13.1 105.05,11.43 104.23,12.25 U8.3 | R13.1 105.98,10.25 106.19,10.03 107.07,10.03 C4.2 | C21.2 104.85,10.05 R13.1
N$8  (via drill 0.2)
  Top 0.2: C21.1 102.53,8.76 v103.4,8.76 | v106.7,16.42 106.7,16.91 D2.A
  Bottom 0.2: v103.4,8.76 103.4,11.82 101.35,13.88 101.35,15.84 101.93,16.42 v106.7,16.42
  pour Top (no thermals): 104.67,18.67 104.67,15.11 105.18,14.61 106.45,13.34 108.48,13.34 108.86,13.72 108.86,18.54 108.73,18.67
N$9
  Top 0.254: U8.4 R25.2 R24.1 100.88,10.14 99.56,10.14 C7.2
N$10
  Top 0.305: R23.2 86.34,17.14 85.66,16.46 C6.2 R22.1 83.55,13.59 U9.3
N$11
  Top 0.406: U6.6 R10.1
N$18
  Top 0.2: U11.3 61.99,8.14 U12.3
N$38  (via drill 0.2)
  Top 0.127: U11.13 61.49,4.31 61.62,4.44 62.67,4.44 62.79,4.32 v62.96,4.32
  Top 0.2: v61.05,9.08 60.71,8.74 U12.1
  Bottom 0.2: v62.96,4.32 60.3,4.32 58.77,5.85 58.77,6.39 58.91,6.53 59.89,6.53 61.05,7.69 v61.05,9.08
POS_DETECT  (via drill 0.2)
  Top 0.2: v65.25,6.48 65.25,6.14 65.44,5.95 R12.1 68.14,5.95 S1.2 | v47.85,13.09 46.43,13.09 U14.14
  Bottom 0.2: v65.25,6.48 65.25,5.91 63.2,3.86 54.66,3.86 51.46,7.07 51.46,8.51 50.93,9.04 49.49,9.04 48.78,9.74 48.78,11.41 47.97,12.23 47.97,12.96 v47.85,13.09
RX  (via drill 0.2)
  Top 0.2: J2.6 73.12,8.08 72.88,7.83 72.88,4.72 72.86,4.7 v72.86,3.43 73.62,2.68 U23.4
  Bottom 0.152: TP3.1 73.42,3.43 v72.86,3.43
SCL  (via drill 0.2, 0.25)
  Top 0.127: v55.52,15.37 55.75,15.6 55.75,16.42 55.64,16.53 54.5,16.53 54.37,16.66 54.37,17.9 54.44,17.97 U24.1 | v41.93,16.44 42.7,17.2 45.05,17.2 45.72,16.53 U14.19
  Top 0.152: v116.35,8.64 116.35,8.89 116.99,9.53 U10.3
  Top 0.2: U15.6 57.42,7.12 58.19,7.89 58.19,9.81 v57.96,10.03 58.09,9.91 59.04,9.91 U16.3 | R27.1 v62.89,11.56 62.89,11.18 65.66,8.41 70.41,8.41 70.64,8.64 70.64,9.55 J2.4 70.62,11.17 v70.64,11.18
  Bottom 0.127: v62.89,11.56 62.89,13.84 61.13,15.6 55.76,15.6 v55.52,15.37 55.37,15.21 55.37,12.51 54.08,11.22 52.26,11.22 50.97,12.51 50.97,14.5 48.91,16.56 42.06,16.56 v41.93,16.44
  Bottom 0.152: v70.64,11.18 69.49,11.18 67.71,12.95 TP7.1
  Bottom 0.2: v57.96,10.03 57.96,10.73 59.12,11.89 60.82,11.89 61.67,11.05 62.38,11.05 v62.89,11.56 | v70.64,11.18 78.18,11.18 79.37,9.99 88.07,9.99 89.52,11.44 93.09,11.44 97.41,7.12 114.84,7.12 v116.35,8.64
SCL_HV  (via drill 0.25)
  Top 0.152: v118.09,13.46 118.09,13.04 117.39,12.34 U10.6
  Top 0.2: v124.86,16.77 124.93,16.83 U13.5
  Bottom 0.2: v118.09,13.46 121.39,16.77 v124.86,16.77
SDA  (via drill 0.2, 0.25)
  Top 0.127: v55.9,14.86 55.38,14.86 55.06,15.18 U24.3 | v41.3,16.2 41.58,16.2 41.76,16.02 42.11,16.02 43.01,16.92 44.83,16.92 45.23,16.51 45.23,15.8 U14.20
  Top 0.152: v115.59,8.64 116.59,9.63 U10.2
  Top 0.2: U15.7 56.92,7.12 57.81,8.01 57.81,9.14 v57.55,9.4 57.55,9.65 57.37,9.84 U16.4 | 61.87,13.46 61,13.46 60.86,13.32 R26.1 | 61.87,13.46 63.4,13.46 64.1,12.76 64.1,10.69 66.05,8.73 69.25,8.73 69.38,8.85 J2.3 69.38,11.57 v69.62,11.81 | v61.87,11.56 61.87,13.46
  Bottom 0.127: 60.86,12.22 60.86,14.61 60.11,15.35 56.39,15.35 v55.9,14.86 55.62,14.58 55.62,12.4 54.19,10.97 52.15,10.97 50.72,12.4 50.72,14.39 48.8,16.31 43,16.31 42.71,16.02 41.76,16.02 41.58,16.2 v41.3,16.2
  Bottom 0.152: v69.62,11.81 69.62,13.08 70.51,13.97 TP6.1
  Bottom 0.2: v57.55,9.4 57.55,9.76 57.48,9.83 57.48,10.71 58.99,12.22 60.86,12.22 61.21,12.22 v61.87,11.56 | v69.62,11.81 78.01,11.81 79.5,10.32 87.93,10.32 89.38,11.77 93.23,11.77 97.55,7.45 114.15,7.45 115.34,8.64 v115.59,8.64
SDA_HV  (via drill 0.25)
  Top 0.152: v117.45,13.46 117.45,12.79 116.99,12.33 U10.7
  Top 0.2: v125.88,16.77 126.39,16.77 126.83,17.21 U13.4
  Bottom 0.2: v125.88,16.77 125.86,16.77 125.31,16.22 122.26,16.22 119.02,12.98 117.76,12.98 117.45,13.29 v117.45,13.46
SENSE1  (via drill 0.2, 0.24)
  Top 0.2: U4.7 36.34,17.19 | U11.12 60.99,3.05 59.47,1.53 57.14,1.53 55.49,3.18 55.49,4.4 54.97,4.92 54.97,8.73 53.36,10.34 52.63,10.34 50.3,12.67 v50.3,12.89 | v36.34,16.07 36.34,17.19 | 36.34,17.19 33.92,17.19 33.25,17.86 27.67,17.86 27.2,17.4 R35.1
  Bottom 0.2: v36.34,16.07 36.75,16.47 40.33,16.47 41.18,15.62 42.73,15.62 43.12,16.02 48.65,16.02 50.3,14.37 v50.3,12.89
SENSE1+
  Top 0.2: U4.5 38.39,15.89 38.89,16.38 38.89,17.78 38.15,18.52 11.6,18.52 8.63,15.55 8.63,9.57 8.21,9.15 8.21,5.91 8.61,5.5 14.25,5.5 R5.1
  Top 0.508: Q5.3 14.37,4.23 R5.1
SENSE1_FILT
  Top 0.2: R35.2 C17.1 23.41,16.65 22.41,15.65 U5.2
SENSE2  (via drill 0.2, 0.24)
  Top 0.2: U4.1 36.85,13.29 36.72,13.42 34.69,13.42 | 34.69,13.42 33.67,13.42 32.57,12.32 28.34,12.32 27.33,11.3 R36.1 | U11.14 61.99,2.65 60.54,1.21 57,1.21 55.17,3.04 55.17,4.26 54.64,4.79 54.64,8.59 53.22,10.01 52.49,10.01 50.47,12.04 v49.27,12.04 | v34.69,13.84 34.69,13.42
  Bottom 0.2: v34.69,13.84 35.38,14.53 40.34,14.53 40.74,14.12 46.83,14.12 47.03,14.32 47.93,14.32 48.63,13.63 48.63,12.87 49.27,12.22 v49.27,12.04
SENSE2+  (via drill 0.2)
  Top 0.127: R6.1 47.23,3.47 46.53,4.17 46.53,6.6 45.49,7.65 45.27,7.65 v45.11,7.81
  Top 0.2: U4.3 38.52,14.59 38.63,14.48 38.63,12.06 v38.51,11.93
  Top 0.508: Q6.3 48.16,2.96 R6.1
  Bottom 0.2: v38.51,11.93 38.54,11.93 42.22,8.26 44.84,8.26 45.11,7.99 v45.11,7.81
SENSE2_FILT
  Top 0.2: R36.2 C18.1 23.53,12.81 23.29,13.05 U5.6
SENSE3  (via drill 0.2, 0.24)
  Top 0.2: U11.15 62.49,2.69 60.67,0.88 56.87,0.88 54.84,2.91 54.84,4.13 54.31,4.65 54.31,8.46 53.09,9.68 52.36,9.68 50.48,11.56 49.42,11.56 v49.32,11.45 | v32.79,13.23 32.73,13.29 U4.14 30.35,13.29 R37.1
  Bottom 0.2: v32.79,13.23 35.4,13.23 36.37,14.2 40.2,14.2 40.61,13.8 46.97,13.8 47.17,14 47.8,14 48.3,13.49 48.3,12.36 49.08,11.58 49.19,11.58 v49.32,11.45
SENSE3+  (via drill 0.2)
  Top 0.2: R7.1 90.54,3.72 90.21,4.05 90.21,5.38 87.37,8.22 v85.49,8.22 | v33.8,14.35 33.44,14.72 32.54,14.72 32.41,14.59 U4.12
  Top 0.508: R7.1 91.08,3.34 91.76,2.66 Q7.3
  Bottom 0.127: v85.49,8.22 84.77,8.94 78.93,8.94 77.92,9.95 69.13,9.95 62.48,16.6 49.49,16.6 49.23,16.85 36.22,16.85 33.8,14.44 v33.8,14.35
SENSE3_FILT
  Top 0.2: C19.1 R37.2 28.81,13.05 U5.9
SENSE4  (via drill 0.2, 0.24)
  Top 0.2: U11.11 60.49,3.11 59.24,1.86 57.27,1.86 55.82,3.31 55.82,4.53 55.3,5.06 55.3,8.86 53.49,10.66 52.77,10.66 50.93,12.49 50.93,12.9 50.49,13.35 v49.84,13.35 | v35.79,15.54 34.47,16.86 33.79,16.86 33.46,17.19 U4.8 30.18,17.19 R38.1
  Bottom 0.2: v35.79,15.54 35.85,15.59 36.54,15.59 37.1,16.14 40.19,16.14 41.08,15.26 42.82,15.26 43.26,15.69 48.5,15.69 49.84,14.35 v49.84,13.35
SENSE4+  (via drill 0.2)
  Top 0.2: R8.1 122.03,3.34 121.56,3.81 v121.56,4.57 | v33.17,15.88 31.66,15.88 U4.10
  Top 0.508: R8.1 123.64,2.66 Q8.3
  Bottom 0.127: v33.17,15.88 34.66,17.36 49.49,17.36 49.74,17.11 62.7,17.11 69.34,10.46 78.13,10.46 79.14,9.45 86.32,9.45 89.42,6.34 90.77,6.34 92.92,8.49 94.59,8.49 96.61,6.48 116.1,6.48 118.01,4.57 v121.56,4.57
SENSE4_FILT
  Top 0.2: U5.13 28.49,15.65 C20.1 R38.2
SENSE_EN  (via drill 0.2)
  Top 0.152: v24.76,9.8 24.03,9.07 24.03,8.26 23.45,7.68 U2.5 | v48.64,14.8 48.64,14.33 47.91,13.59 U14.15
  Top 0.2: v64.78,17.45 64.58,17.65 R9.2 63.66,17.08 63.52,16.93 63.03,16.93 62.73,16.64 59.97,16.64 58.67,15.34 57.4,15.34 v56.94,14.88 | v64.71,16.05 64.63,16.12 U3.4
  Bottom 0.152: v48.64,14.8 48.43,14.8 48.22,15.01 46.75,15.01 46.55,14.81 41.02,14.81 40.13,15.7 37.08,15.7 36.47,15.09 35.3,15.09 34.01,13.79 28.32,13.79 25.12,10.59 24.99,10.46 24.76,10.23 v24.76,9.8
  Bottom 0.2: v48.64,14.8 48.75,14.8 49.37,14.17 49.37,13.16 52,10.54 54.47,10.54 56.8,12.88 56.8,14.74 v56.94,14.88 | v64.78,17.45 64.78,16.12 v64.71,16.05
SW1
  pour Top (no thermals): 81.81,14.35 78.64,14.35 78.51,14.48 76.1,14.48 75.97,14.35 75.97,11.81 76.22,11.56 81.81,11.56 81.94,11.68 81.94,14.22
SWITCHED_SENSE
  Top 0.254: U16.1 59.94,7.94 60.26,8.26 60.26,8.96 60.85,9.56 61.9,9.56 62.01,9.67 U12.4
TX  (via drill 0.2)
  Top 0.2: U21.2 74.51,4.32 74.26,4.57 v73.81,4.57 73.3,5.08 73.3,7.62 73.81,8.13 73.81,10.2 73.62,10.39 72,10.39 71.88,10.26 J2.5
  Bottom 0.152: v73.81,4.57 76.6,4.57 TP2.1
VHEATER
  Top 0.406: U6.3 U6.2 119.53,16.51 119.78,16.26 119.78,15.35 120.8,14.34 121.41,14.34 125.7,10.04 J1.5
VPORT1_OUT
  Top 0.2: U4.6 38.28,16.54 38.5,16.76 38.5,17.7 38.01,18.19 11.74,18.19 8.96,15.41 8.96,9.43 8.53,9.01 8.53,6.04 8.75,5.83 13.13,5.83 R5.2 14.27,6.96
  Top 0.508: J3.1 14.3,7.75 | 14.3,7.75 14.3,7 14.27,6.96 | R14.1 14.3,7.75
VPORT1_OUT_SENSE  (via drill 0.2, 0.25)
  Top 0.152: v20.09,8.13 19.72,7.76 R18.2
  Top 0.2: U11.1 63.04,5.58 63.62,6.16 v63.62,6.32 | v64.67,6.22 65.08,5.8 65.08,5.68 66.65,4.12 v67.19,4.12
  Top 0.254: R14.2 18.93,7.75 R18.2
  Bottom 0.127: v20.09,8.13 21.96,6.26 21.96,5.16 24.45,2.68 39.06,2.68 39.19,2.81 43,2.81 43.42,2.38 47.36,2.38 47.75,2.77 53.4,2.77 53.91,2.26 65.02,2.26 66.87,4.12 v67.19,4.12
  Bottom 0.2: v64.67,6.22 64.57,6.32 v63.62,6.32
VPORT2_OUT  (via drill 0.2)
  Top 0.127: R6.2 47.08,5.17 46.78,5.46 46.78,6.73 45.28,8.23 44.94,8.23 44.52,7.82 v44.52,7.8
  Top 0.2: U4.2 38.15,13.94 38.27,13.82 38.27,13.11 38,12.83 v38,12.32
  Top 0.508: R6.2 48.16,6.73 | 48.16,6.73 48.16,7.12 J4.1 | R15.1 49.72,6.73 48.16,6.73
  Bottom 0.2: v44.52,7.8 42.2,7.8 38.52,11.48 38.32,11.48 38,11.8 v38,12.32
VPORT2_OUT_SENSE  (via drill 0.2)
  Top 0.2: U11.5 60.99,7.02 60.69,7.31 v59.46,7.31
  Top 0.254: 52.69,6.86 R19.2 | R15.2 52.69,6.86 | v52.22,7.75 52.47,7.75 52.69,7.53 52.69,6.86
  Bottom 0.2: v52.22,7.75 54.33,5.64 55.83,5.64 57.12,6.93 58.39,6.93 58.77,7.31 v59.46,7.31
VPORT3_OUT  (via drill 0.2)
  Top 0.2: v33.17,14.22 32.89,13.94 U4.13 | v86,8.67 87.38,8.67 90.63,5.42 R7.2
  Top 0.508: 91.08,7.11 90.66,7.11 J5.1 | R7.2 91.08,7.11 | 91.08,7.11 R16.1
  Bottom 0.127: v33.17,14.22 33.17,14.35 35.93,17.11 49.38,17.11 49.64,16.85 62.59,16.85 69.23,10.21 78.02,10.21 79.04,9.19 85.48,9.19 v86,8.67
VPORT3_OUT_SENSE  (via drill 0.2, 0.25)
  Top 0.2: U11.2 62.49,7.12 v62.6,7.24 | v94.38,8 94.47,7.91 R16.2 95.64,7.11 R20.2
  Bottom 0.2: v62.6,7.24 64.32,8.96 71.75,8.96 73.43,7.28 82.41,7.28 83.45,8.32 84.74,8.32 85.31,7.76 87.28,7.76 89.14,5.91 90.85,5.91 92.94,8 v94.38,8
VPORT4_OUT  (via drill 0.2, 0.35)
  Top 0.2: R8.2 121.73,5.04 v121.56,5.21 | v33.17,16.64 33.07,16.54 U4.9
  Top 0.508: R8.2 v122.96,6.73 R17.1
  Bottom 0.127: v33.17,16.64 34.15,17.62 49.59,17.62 49.85,17.36 62.8,17.36 69.45,10.72 78.23,10.72 79.25,9.7 86.43,9.7 89.53,6.6 90.66,6.6 92.82,8.75 95.2,8.75 97.22,6.73 116.21,6.73 117.73,5.21 v121.56,5.21
  Bottom 0.508: v122.96,6.73 123.62,7.39 128.78,7.39 130.38,8.99 130.38,10.25 J1.2
VPORT4_OUT_SENSE  (via drill 0.2, 0.25)
  Top 0.2: U11.4 v61.48,7.24 | R17.2 126.41,6.78 v127.28,6.78 127.88,6.78 R21.2
  Bottom 0.2: v61.48,7.24 61.92,7.24 62.4,6.75 62.8,6.75 64.62,8.57 71.67,8.57 73.3,6.95 82.55,6.95 83.53,7.94 84.66,7.94 85.17,7.43 87.15,7.43 89,5.58 91.63,5.58 92.07,6.02 114.81,6.02 116.75,4.08 122.27,4.08 124.74,6.55 127.05,6.55 v127.28,6.78
VREF  (via drill 0.25)
  Top 0.254: U5.10 24.41,13.7 | 24.41,13.7 U5.5 | U5.12 24.41,15 | 24.41,15 U5.3 | 24.41,15 v24.41,14.34 24.41,13.7 | v19.58,15.11 19.19,14.72 R11.1 15.39,14.72 15.04,14.72 14.53,14.72 D1.1
  Bottom 0.254: v24.41,14.34 23.79,13.72 21.99,13.72 20.6,15.11 v19.58,15.11

## Text on the board
tDocu: Port4 | Port1 | Talon - SDI-12 / v1.4 / Bobby Schulz | Port2 | Port3
bDocu: SCL | SDA | GND | DIR | TX | RX | DATA | SN